# EasyEDA Pro project Project_file_OUR phone_2025-04-02.epro, schematic OURS PHONE_CONNECTORS_FLIP_1

## Sheets
1 CONNECTORS: Board Name: OURS PHONE_CONNECTORS_FLIP_1; Create Date: 2025-02-10; Page Name: CONNECTORS; Project Name: BackupProjects_abdulrehmanbinafsar_personal_0_20241230; Schematic Name: OURS PHONE_CONNECTORS_FLIP_1; Update Date: 2025-02-20; Add into BOM: yes; Company: Your Company; Convert to PCB: yes; Date: 2024-12-04; Draw By: Abdul Rehman; REV: 1.0; Sheet: 1/1
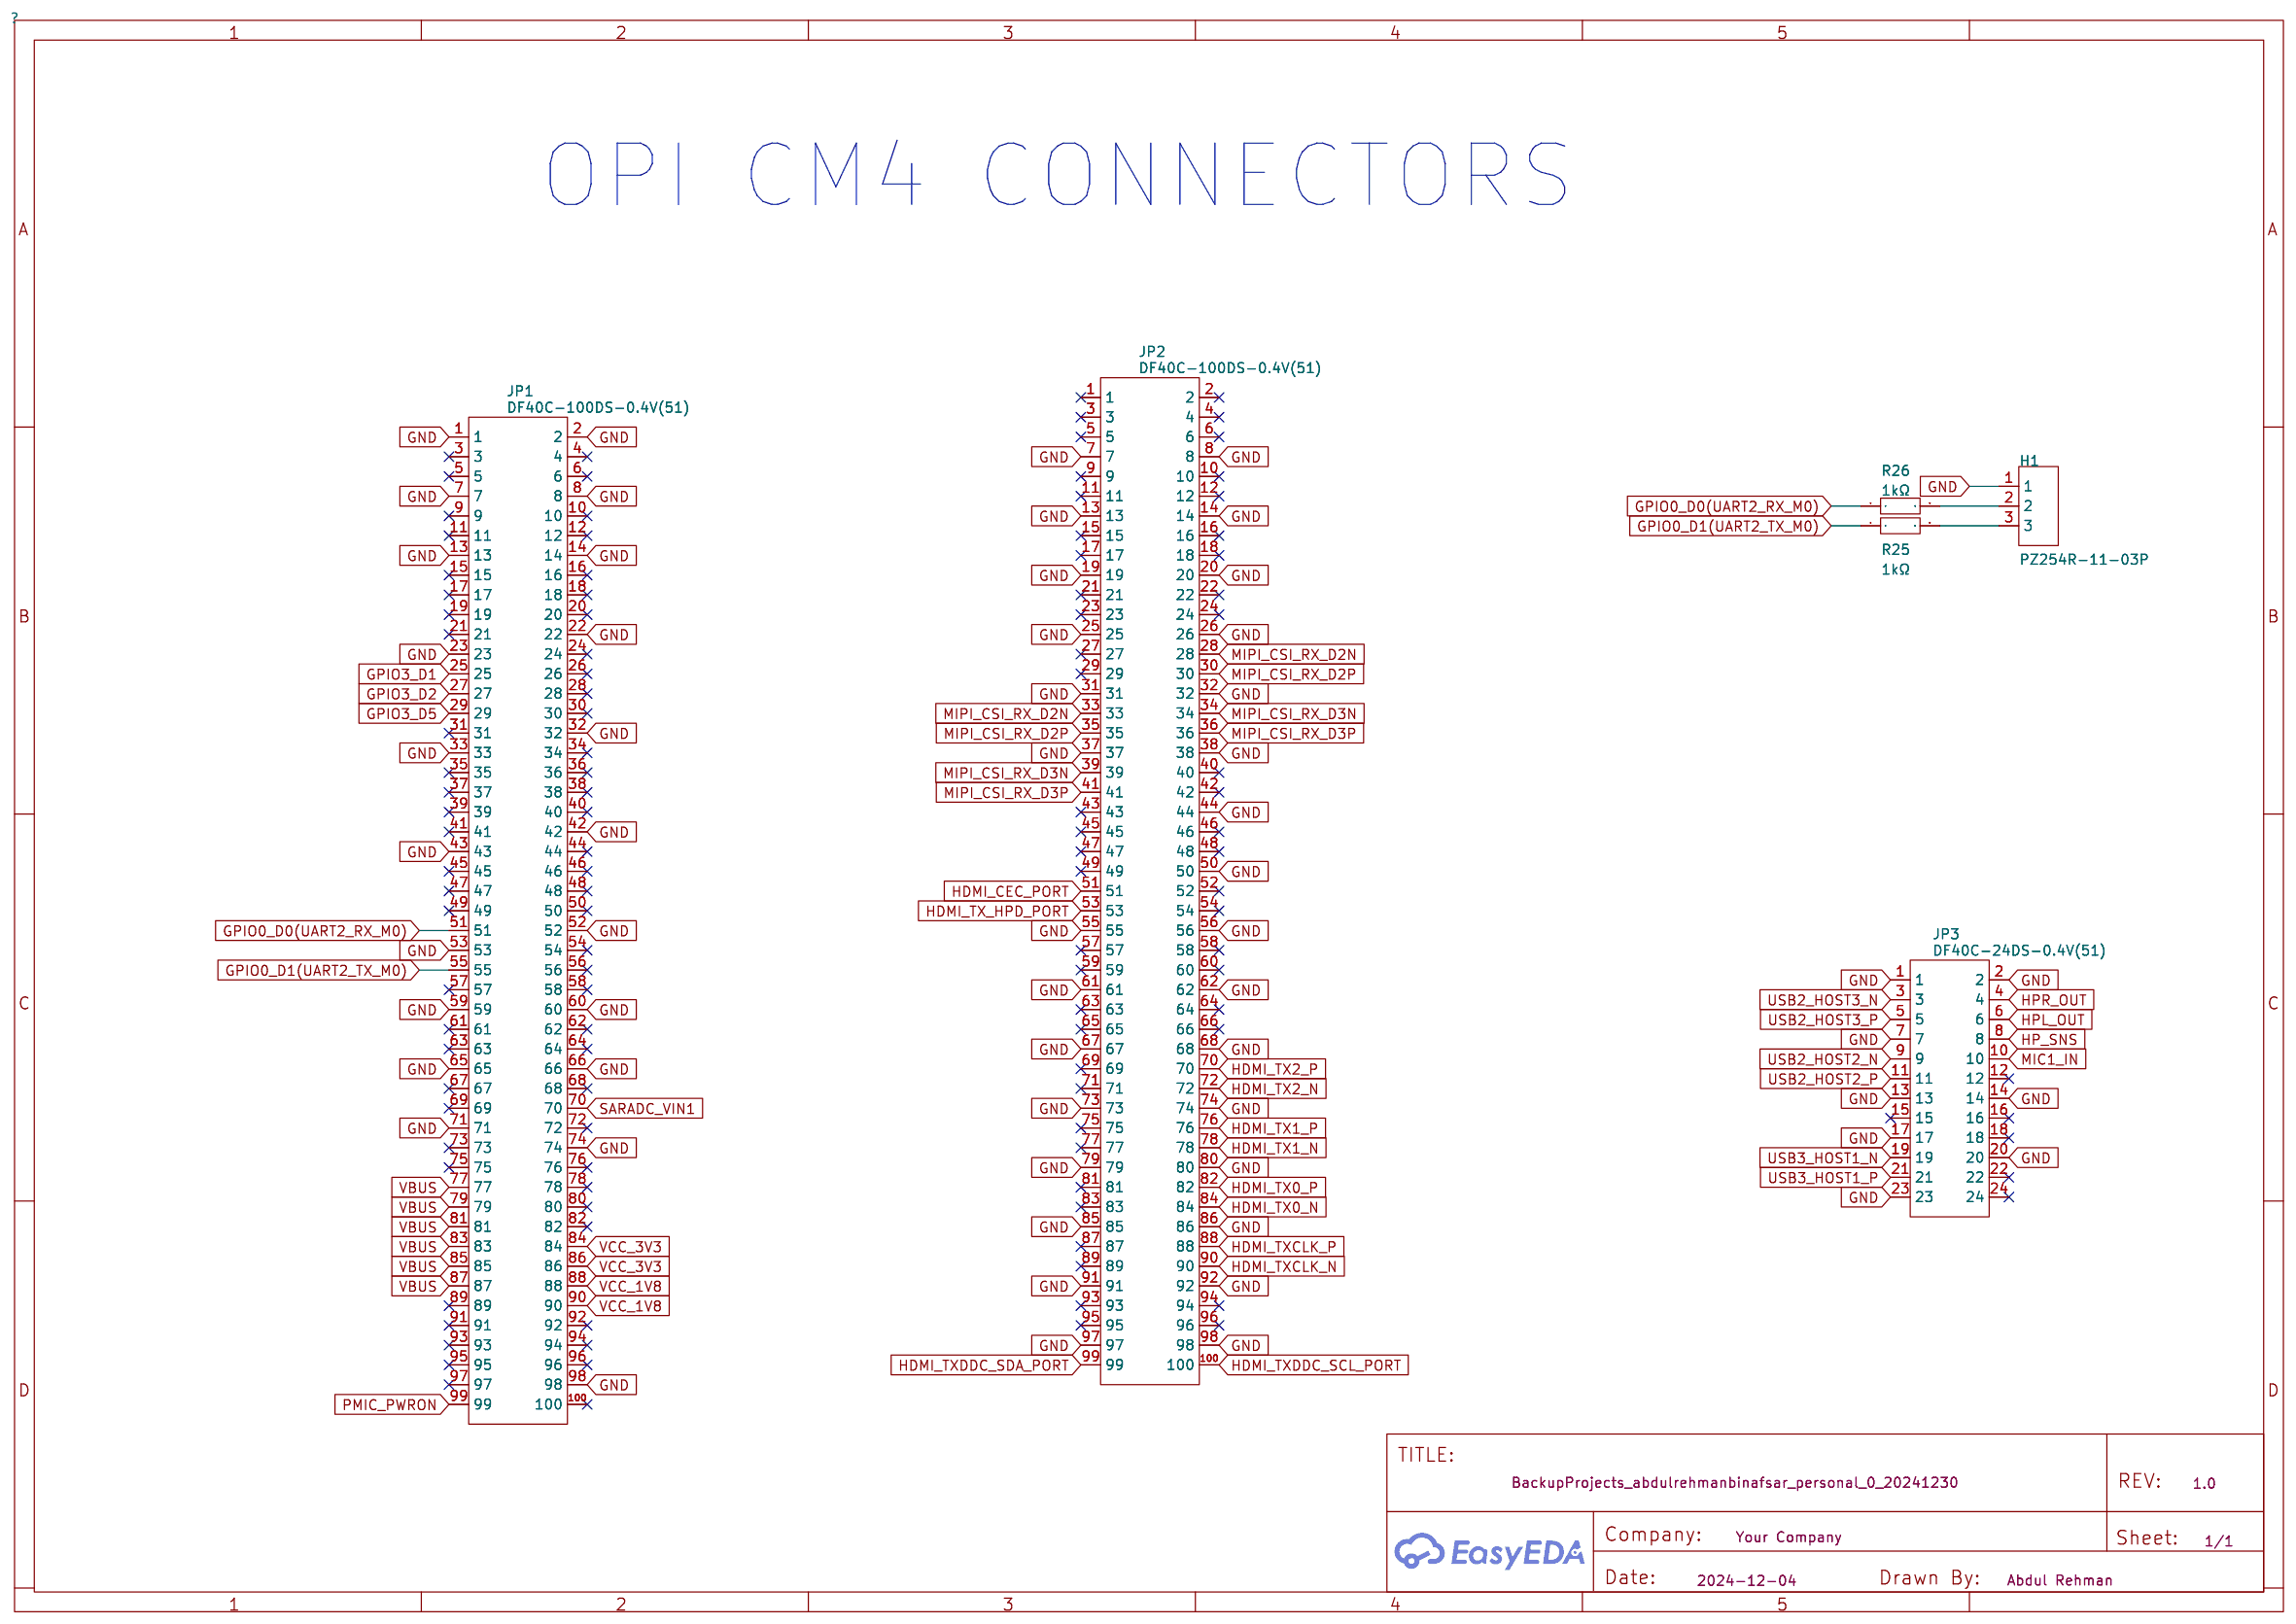
[diagram p5: CONNECTORS]
2 CIRCUITRY: Create Date: 2025-02-11; Page Name: CIRCUITRY; Update Date: 2025-04-01; Date: 2024-12-06
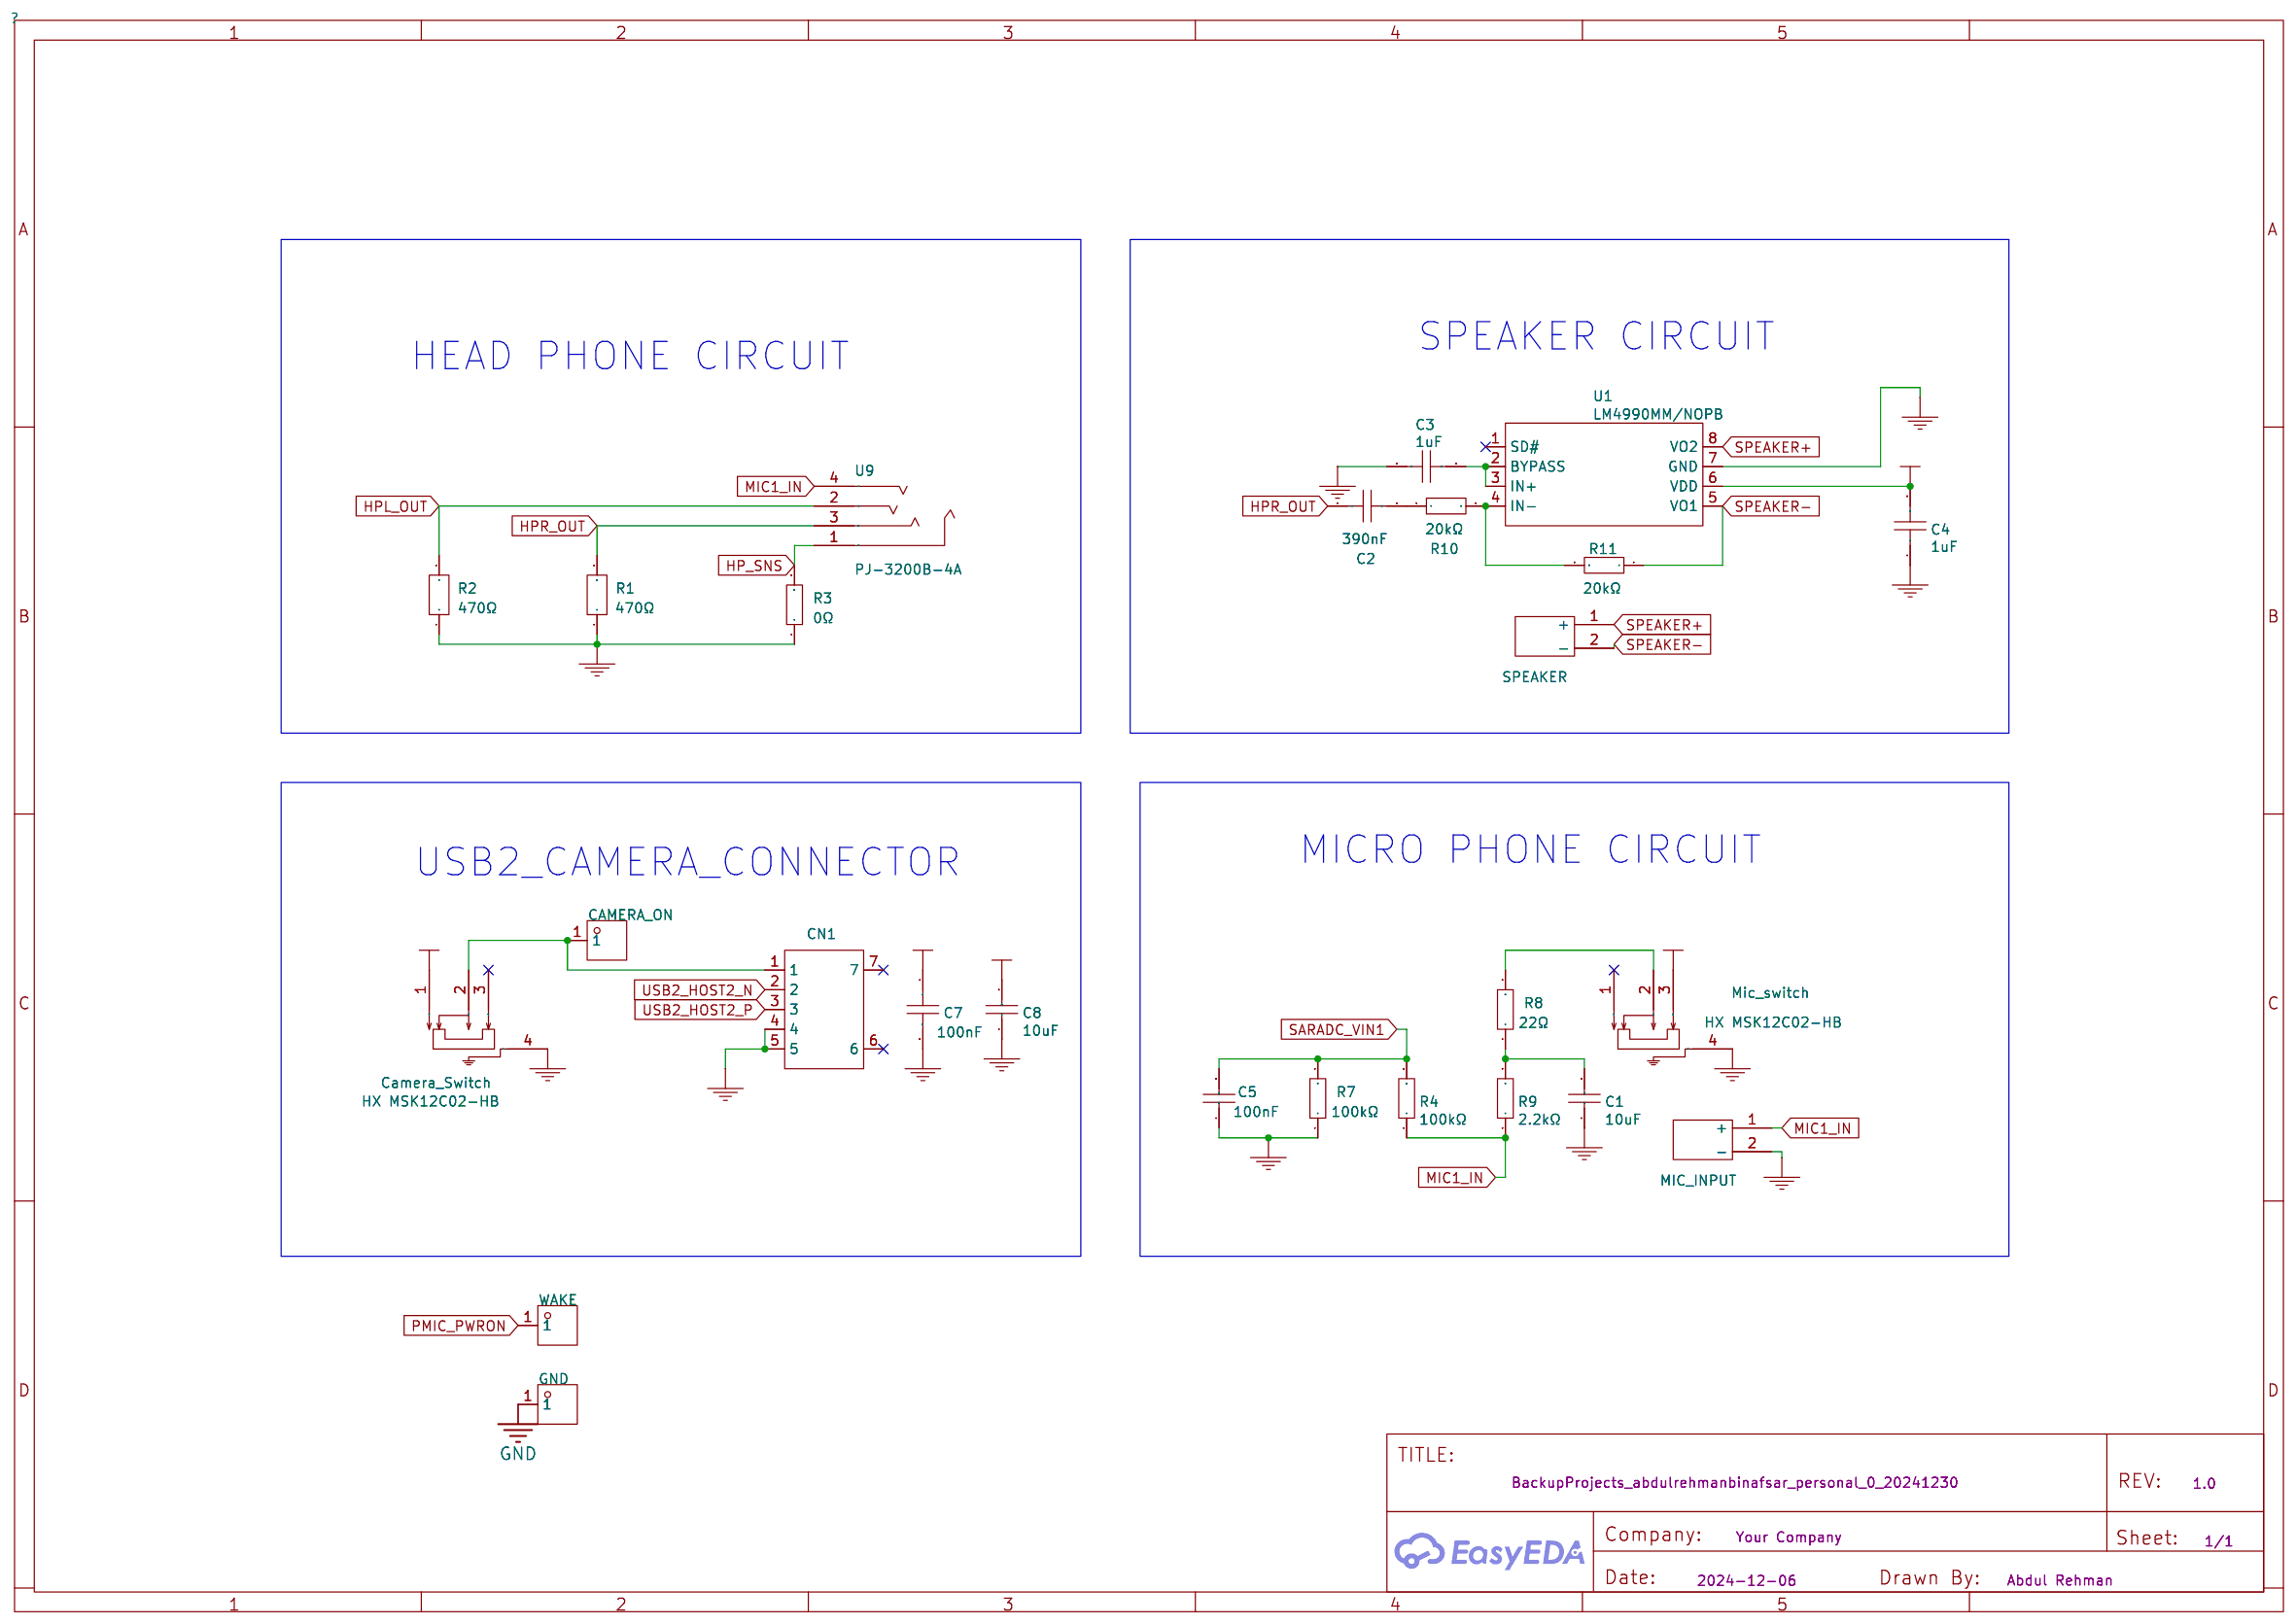
[diagram p6: CIRCUITRY]
3 SIM Module: Page Name: SIM Module; Update Date: 2025-02-26; Date: 2024-12-06
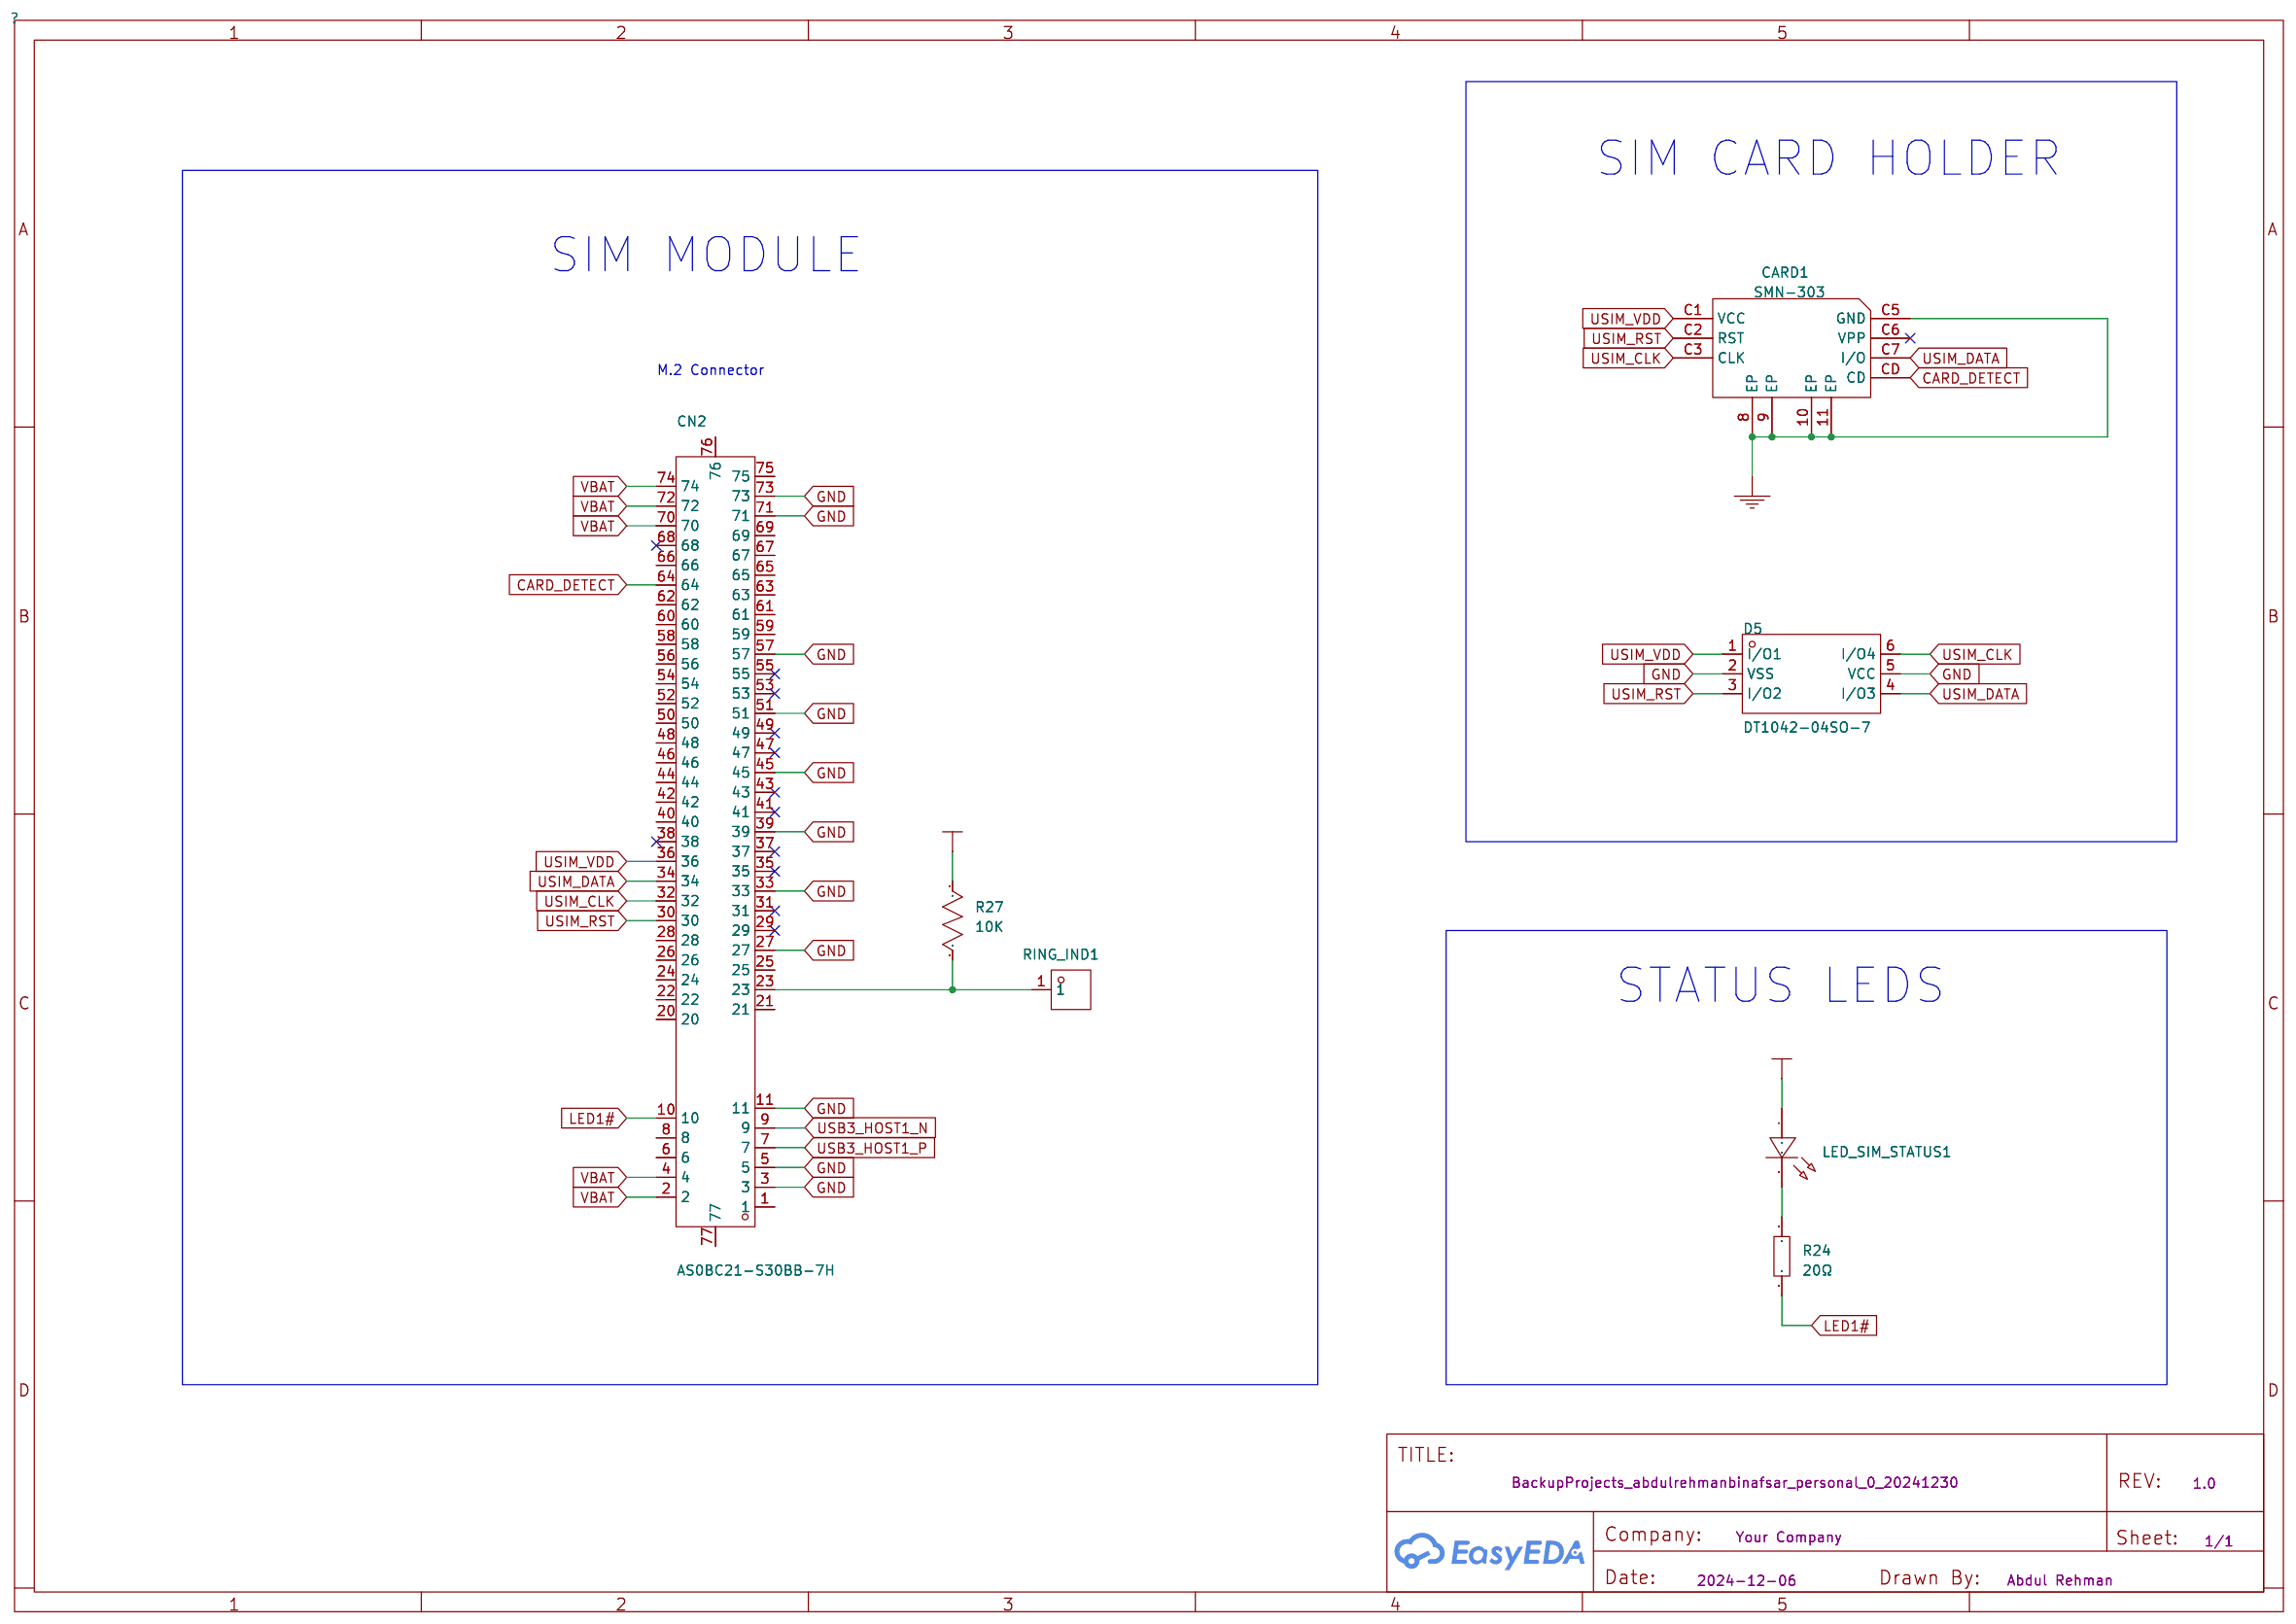
[diagram p7: SIM Module]
4 CPBR CIRCUIT: Create Date: 2025-02-11; Page Name: CPBR CIRCUIT; Update Date: 2025-04-01; Date: 2024-12-08
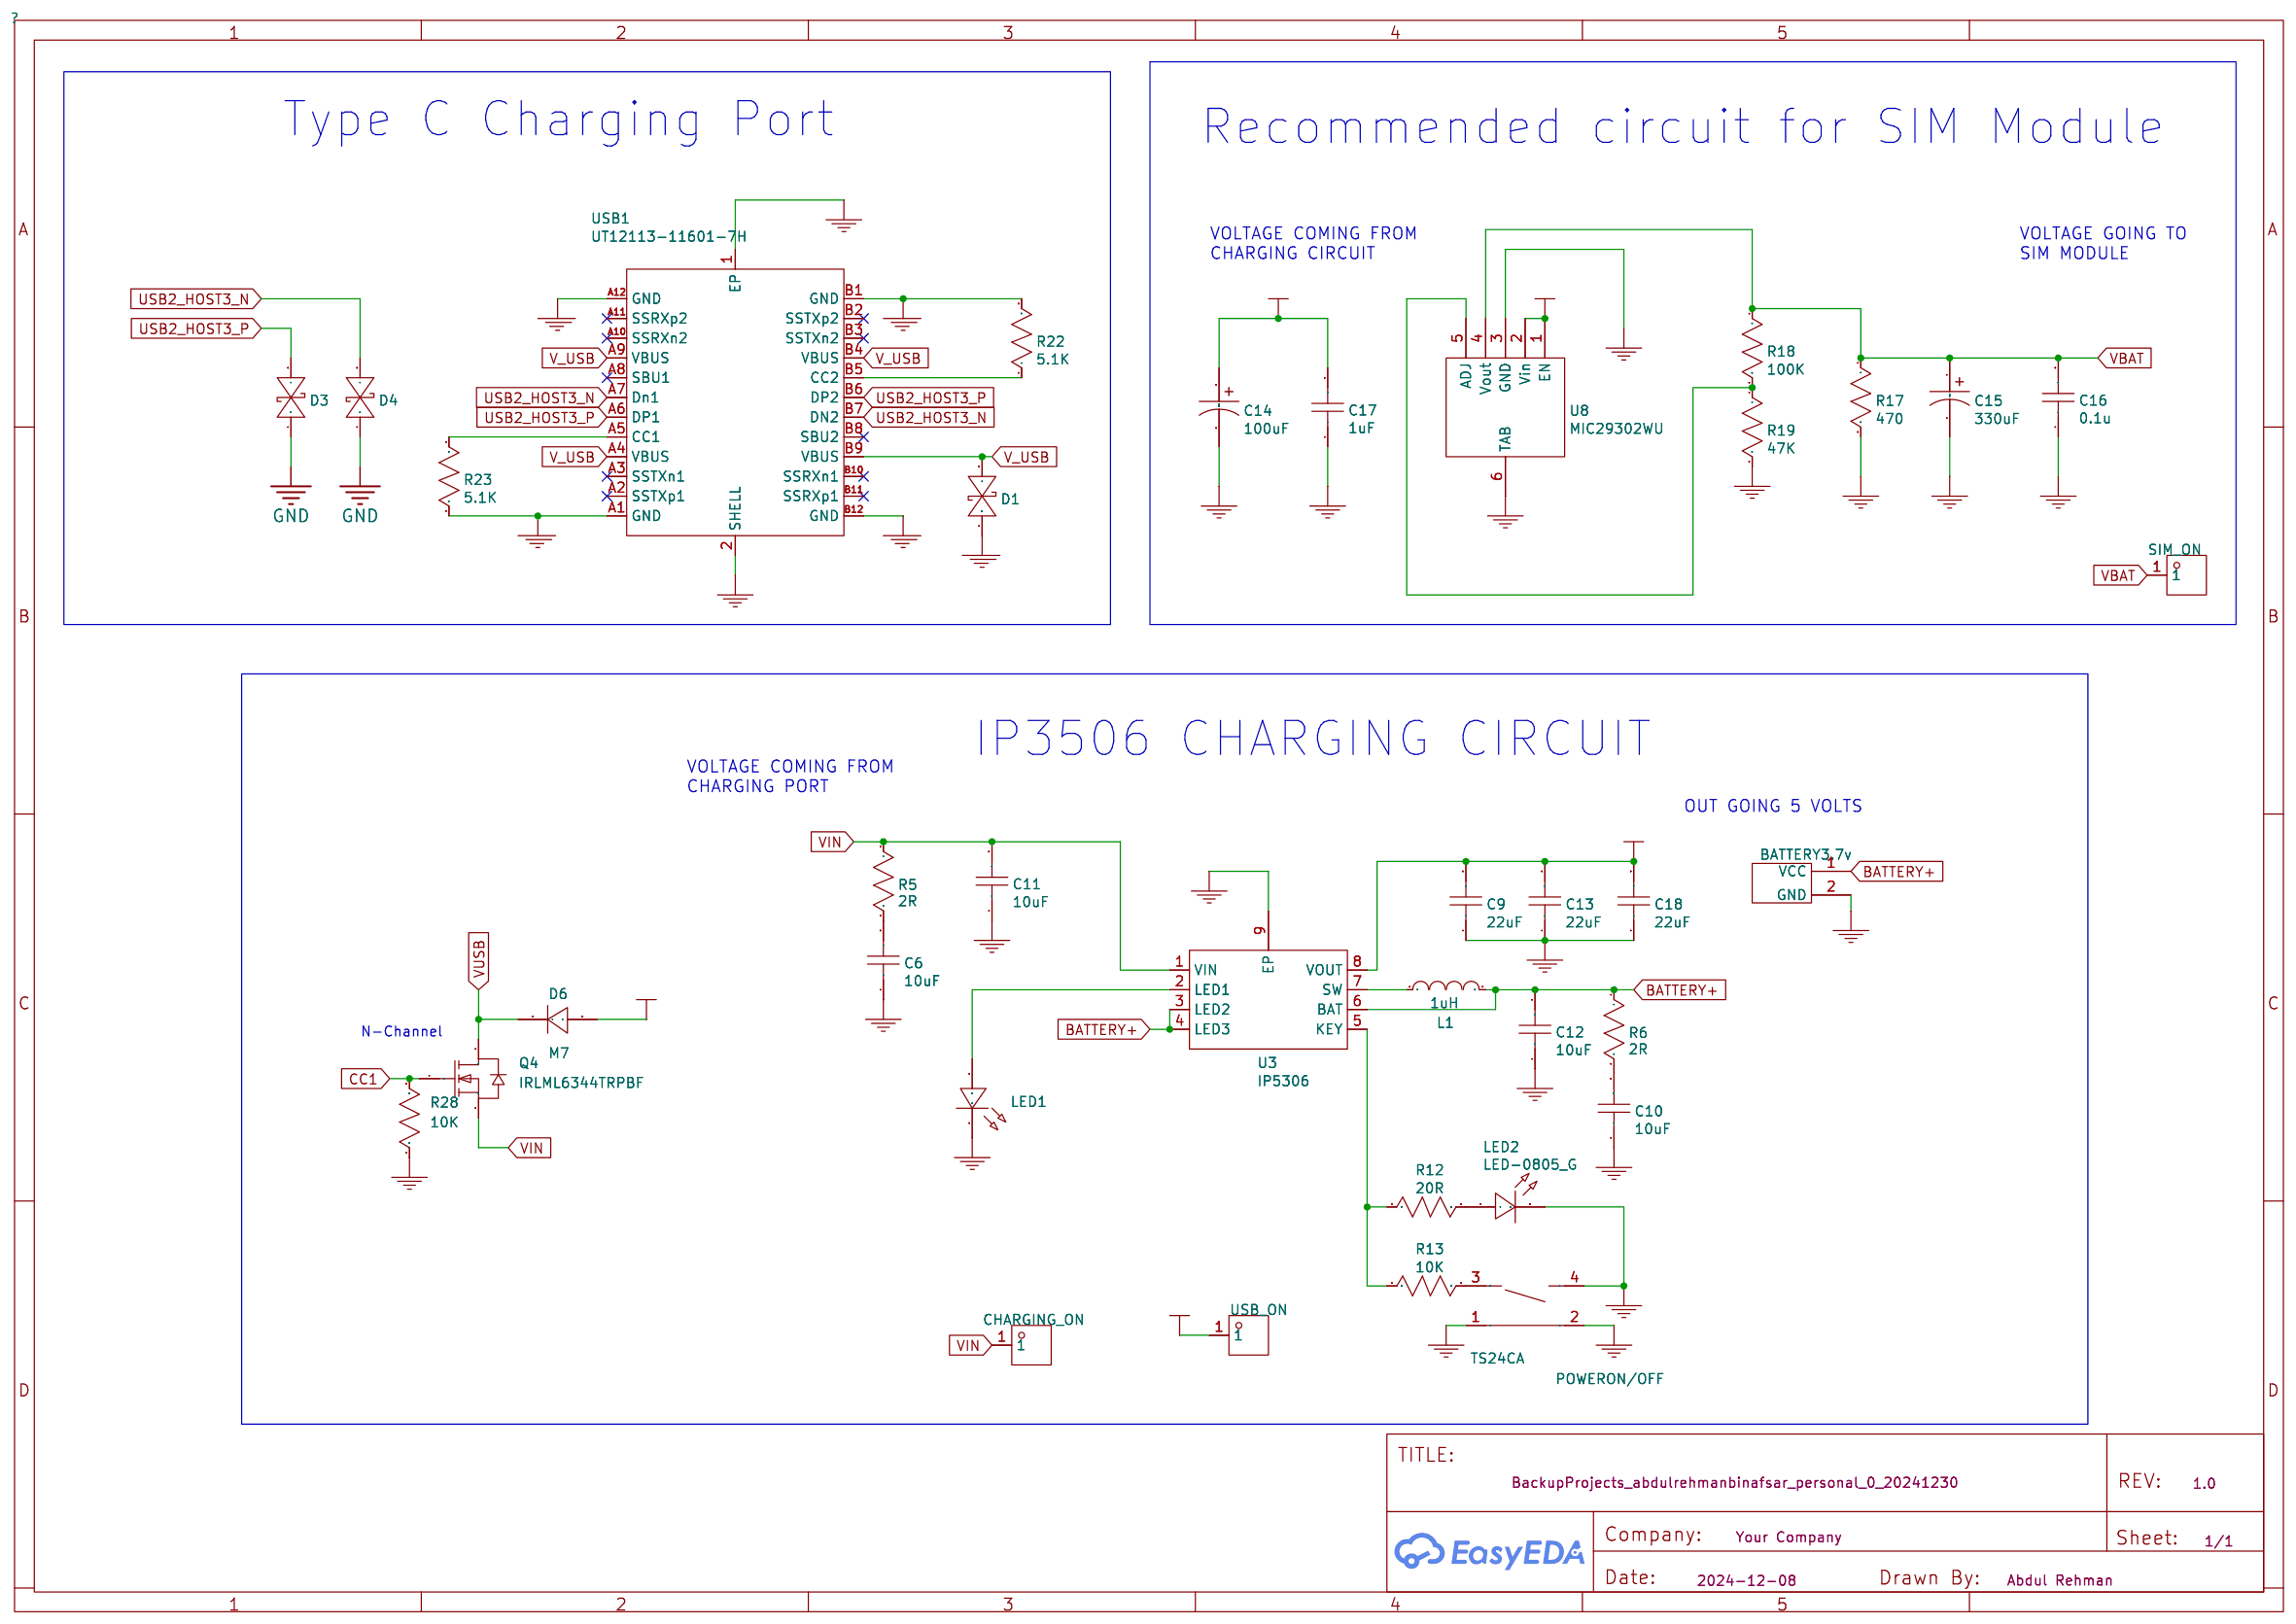
[diagram p8: CPBR CIRCUIT]
5 HDMI PORT: Create Date: 2025-02-11; Page Name: HDMI PORT; Update Date: 2025-04-01; Date: 2024-12-09
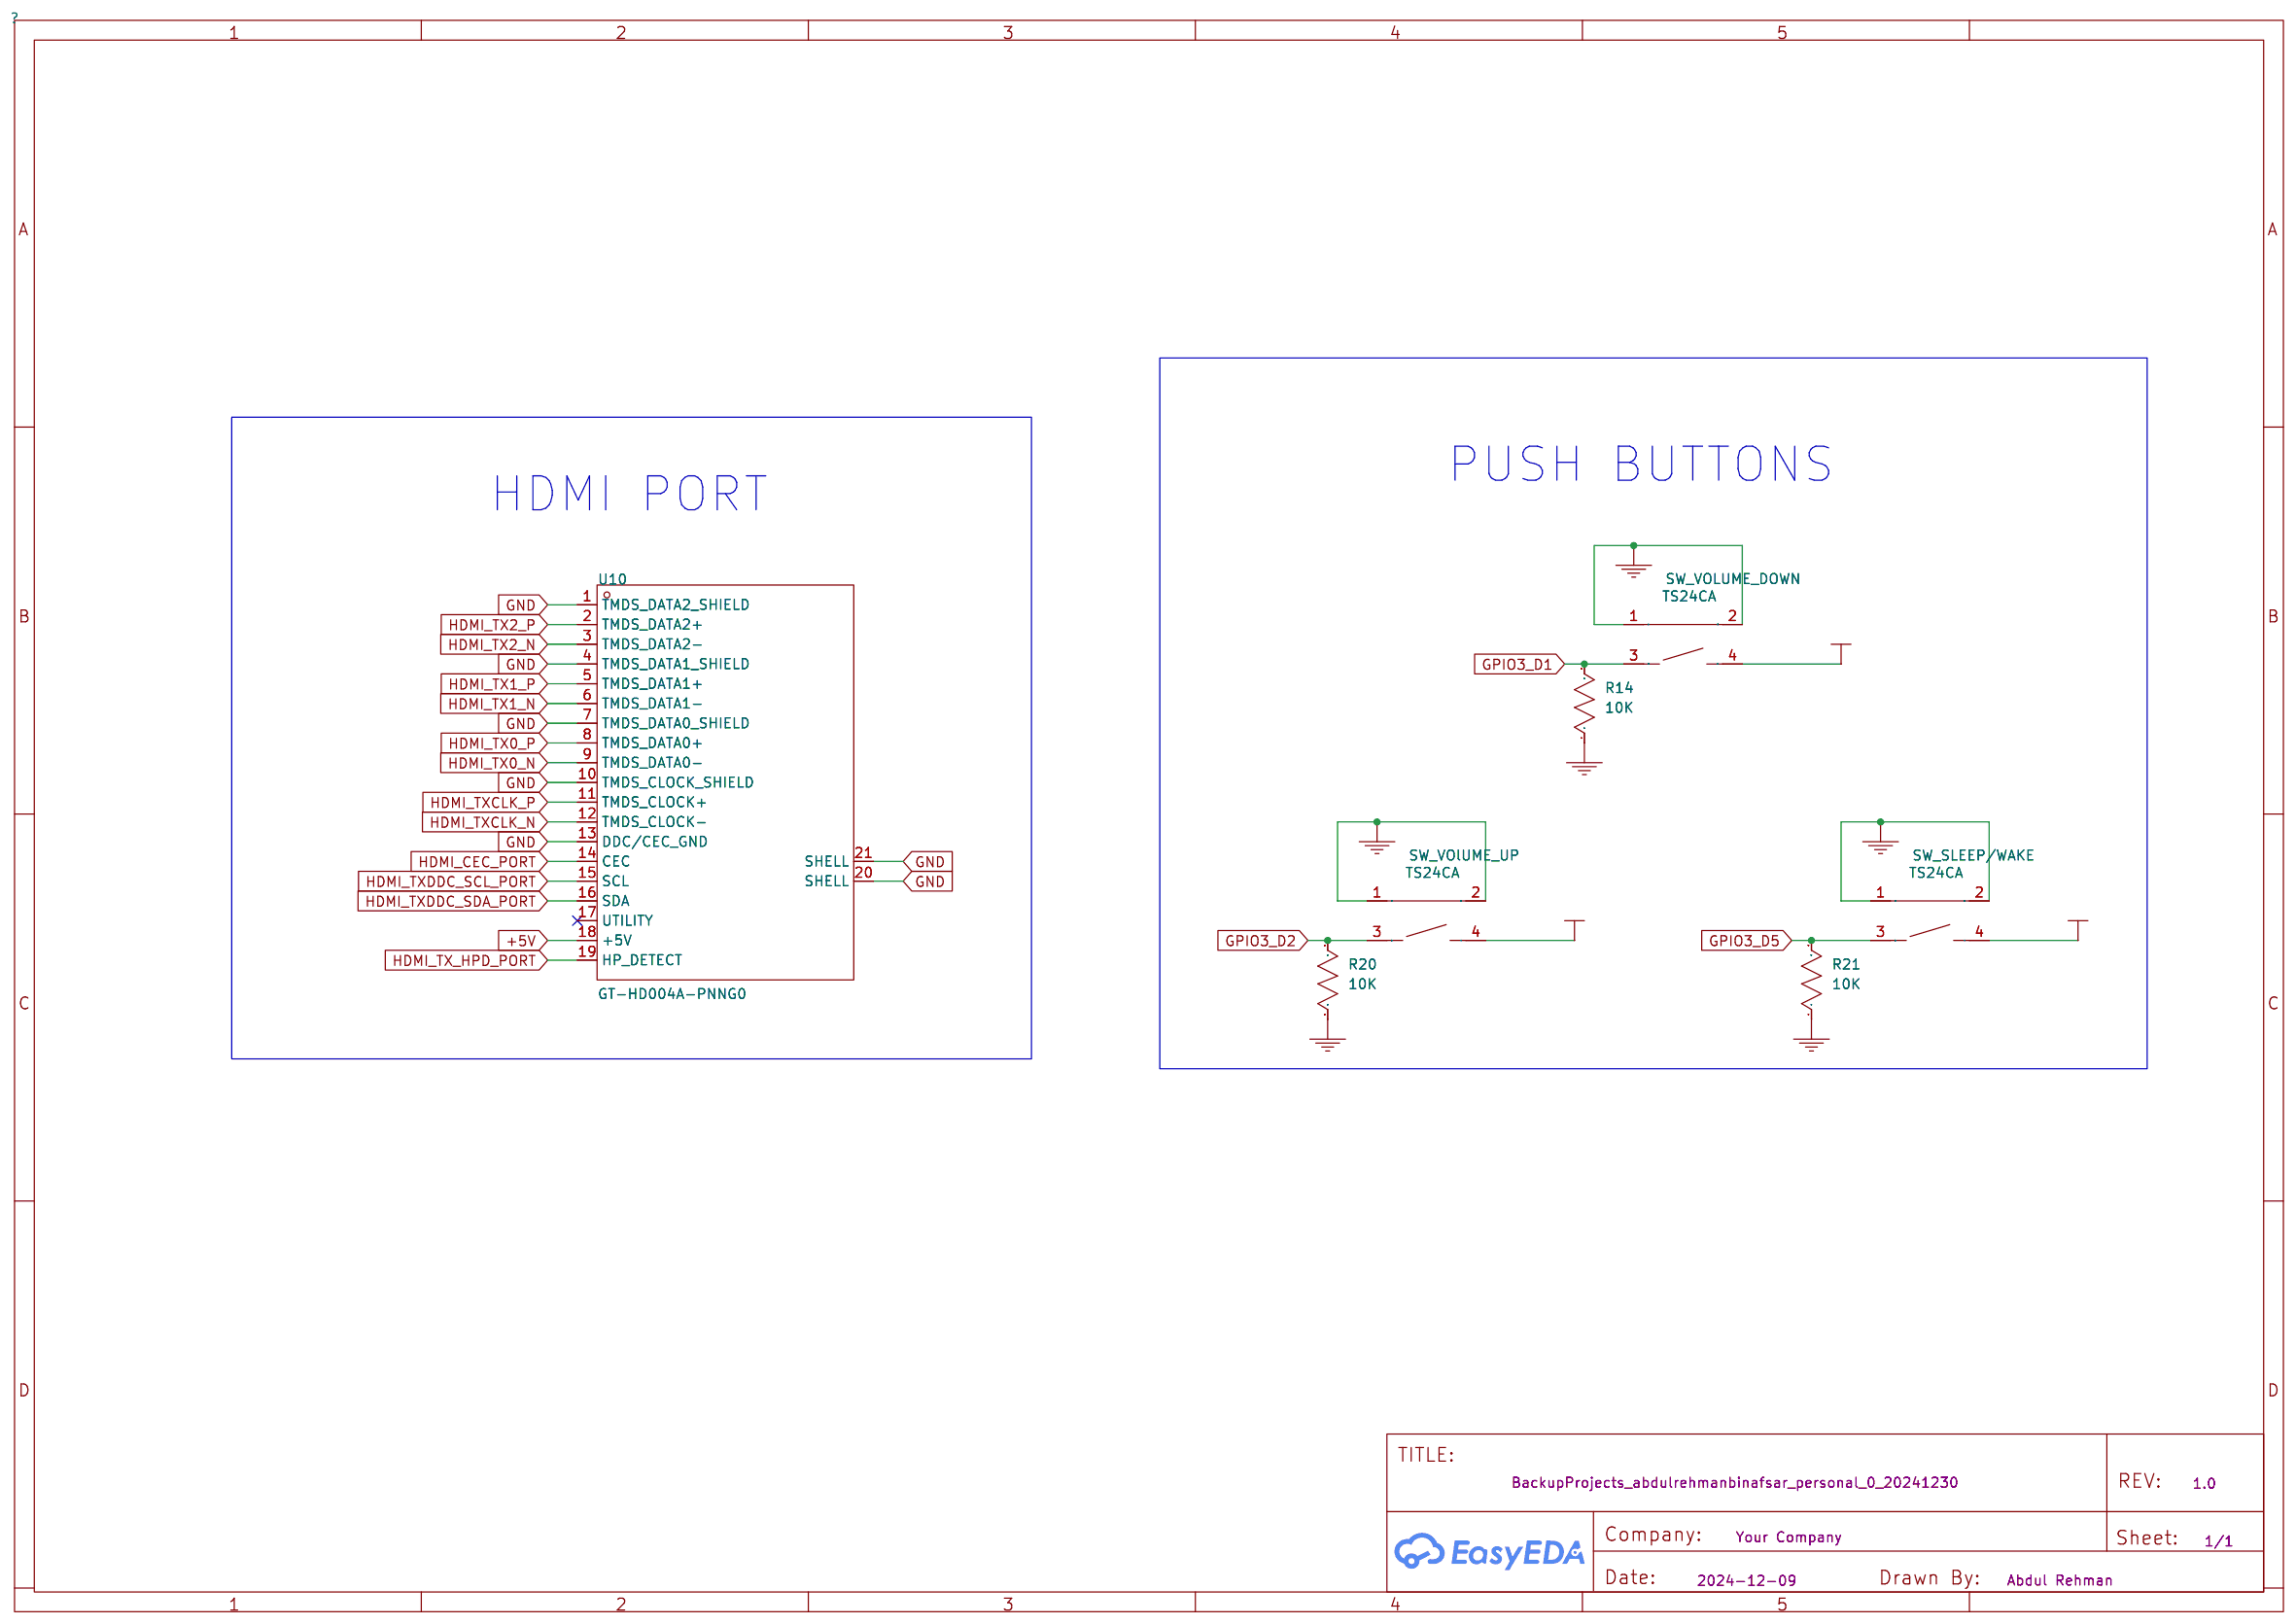
[diagram p9: HDMI PORT]

## Parts
sheet CIRCUITRY
C1  10uF  [C0402]
C2  390nF  [C0402]
C3  1uF  [C0402]
C4  1uF  [C0402]
C5  100nF  [C0402]
C7  100nF  [C0402]
C8  10uF  [C0402]
CAMERA_ON  TP-橘色测试点  [TESTPOINT-TH_BD3.2]  (no BOM)
Camera_Switch  HX MSK12C02-HB  [SW-SMD_MSK12C02-HB]
CN1  SM05B-SRSS-TB (LF)(SN)  [CONN-SMD_SM05B-SRSS-TB-LF-SN]
GND  TP-橘色测试点  [TESTPOINT-TH_BD3.2]  (no BOM)
MIC_INPUT  NOB  [BATTERY SYMBOL]  (no BOM)
Mic_switch  HX MSK12C02-HB  [SW-SMD_MSK12C02-HB]
R1  470Ω  [R0402]
R2  470Ω  [R0402]
R3  0Ω  [R0402]
R4  100kΩ  [R0402]
R7  100kΩ  [R0402]
R8  22Ω  [R0402]
R9  2.2kΩ  [R0402]
R10  20kΩ  [R0402]
R11  20kΩ  [R0402]
SPEAKER  NOB  [BATTERY SYMBOL]  (no BOM)
U1  LM4990MM/NOPB  [MSOP-8_L3.0-W3.0-P0.65-LS5.0-BL]
U9  PJ-3200B-4A  [AUDIO-TH_PJ-3200B-4A]
WAKE  TP-橘色测试点  [TESTPOINT-TH_BD3.2]  (no BOM)
sheet CONNECTORS
H1  PZ254R-11-03P  [HDR-TH_3P-P2.54-H-M-W10.4]
JP1  DF40C-100DS-0.4V(51)  [CONN-SMD_DF40C-100DS-0.4V-51]
JP2  DF40C-100DS-0.4V(51)  [CONN-SMD_DF40C-100DS-0.4V-51]
JP3  DF40C-24DS-0.4V(51)  [CONN-SMD_DF40C-24DS-0.4V51]
R25  1kΩ  [R0603]
R26  1kΩ  [R0603]
sheet CPBR CIRCUIT
BATTERY3.7v  NOB  [BATTERY SYMBOL]  (no BOM)
C6  10uF  [C0805]
C9  22uF  [C0805]
C10  10uF  [C0805]
C11  10uF  [C0805]
C12  10uF  [C0805]
C13  22uF  [C0805]
C14  100uF  [CASE-A_3216]
C15  330uF  [CASE-A_3216]
C16  0.1u  [C1206]
C17  1uF  [C1206]
C18  22uF  [C0805]
CHARGING_ON  TP-橘色测试点  [TESTPOINT-TH_BD3.2]  (no BOM)
D1  AZ5825-01F  [DFN-2L_L1.0-W0.6-P0.65-BI]
D3  AZ5825-01F  [DFN-2L_L1.0-W0.6-P0.65-BI]
D4  AZ5825-01F  [DFN-2L_L1.0-W0.6-P0.65-BI]
D6  M7  [SMA_L4.3-W2.6-LS5.2-RD]
L1  1uH  [IND-SMD_L2.5-W2.0]
LED1  LED-0603_G  [LED0603_GREEN]
LED2  LED-0805_G  [LED0805_GREEN]
POWERON/OFF  TS24CA  [SW-SMD_TS24CA]
Q4  IRLML6344TRPBF  [SOT-23-3_L2.9-W1.6-P1.90-LS2.8-BR]
R5  2R  [R0603]
R6  2R  [R0603]
R12  20R  [R0603]
R13  10K  [R0603]
R17  470  [R1206]
R18  100K  [R1206]
R19  47K  [R1206]
R22  5.1K  [R0805]
R23  5.1K  [R0805]
R28  10K  [R0603]
SIM_ON  TP-橘色测试点  [TESTPOINT-TH_BD3.2]  (no BOM)
U3  IP5306  [ESOP-8_L4.9-W3.9-P1.27-LS6.0-BL-EP]
U8  MIC29302WU  [TO-263-5_L10.2-W9.9-P1.70-LS14.4-TL]
USB1  UT12113-11601-7H  [USB-C-SMD_UT12113-11601-7H]
USB_ON  TP-橘色测试点  [TESTPOINT-TH_BD3.2]  (no BOM)
sheet HDMI PORT
R14  10K  [R0603]
R20  10K  [R0603]
R21  10K  [R0603]
SW_SLEEP/WAKE  TS24CA  [SW-SMD_TS24CA]
SW_VOLUME_DOWN  TS24CA  [SW-SMD_TS24CA]
SW_VOlUME_UP  TS24CA  [SW-SMD_TS24CA]
U10  GT-HD004A-PNNG0  [HDMI-SMD_GT-HD004A-FNNG0]
sheet SIM Module
CARD1  SMN-303  [SIM-SMD_SMN-303]
CN2  AS0BC21-S30BB-7H  [CONN-SMD_AS0BC21-S30BB-7H]
D5  DT1042-04SO-7  [SOT-26_L3.0-W1.6-P0.95-LS2.8-BL]
LED_SIM_STATUS1  LED-0805_B  [LED0805_BLUE]
R24  20Ω  [R0805]
R27  10K  [R0603]
RING_IND1  TP-橘色测试点  [TESTPOINT-TH_BD3.2]  (no BOM)

## Library data of the parts
C1 C8 = 10uF: Supplier: LCSC; Manufacturer: YAGEO(国巨); Manufacturer Part: CL05A106MQ5NUNC; Supplier Part: C15525; JLCPCB Part Class: Extended Part
C2 = 390nF: Supplier: LCSC; Supplier Part: C7393858; Manufacturer: CCTC(三环); Manufacturer Part: TCC0402X5R394K160AT; JLCPCB Part Class: Extended Part
C3 C4 = 1uF: Supplier: LCSC; Supplier Part: C318573; Manufacturer: SAMSUNG(三星); Manufacturer Part: CL05A105MQ5NNNC; JLCPCB Part Class: Extended Part
C5 = 100nF: Supplier: LCSC; Supplier Part: C106204; Manufacturer: YAGEO(国巨); Manufacturer Part: CC0402KRX5R7BB104; JLCPCB Part Class: Extended Part
C7 = 100nF: Supplier: LCSC; Supplier Part: C576741; Manufacturer: YAGEO(国巨); Manufacturer Part: CC0402MRX5R7BB104; JLCPCB Part Class: Extended Part
CAMERA_ON CHARGING_ON GND RING_IND1 SIM_ON USB_ON WAKE = TP-橘色测试点: Supplier Part: C9900007421; Supplier Footprint: TESTPOINT-TH_BD-2P-P2.00; JLCPCB Part Class: Extended Part; Supplier: LCSC
Camera_Switch Mic_switch = HX MSK12C02-HB: Supplier: LCSC; Supplier Part: C5149817; Manufacturer: hanxia(韩下); JLCPCB Part Class: Extended Part
CN1 = SM05B-SRSS-TB (LF)(SN): Supplier: LCSC; Supplier Part: C136657; Manufacturer: JST; Manufacturer Part: SM05B-SRSS-TB(LF)(SN); JLCPCB Part Class: Extended Part
BATTERY3.7v MIC_INPUT SPEAKER = NOB
R1 R2 = 470Ω: Supplier: LCSC; Supplier Part: C881295; Manufacturer: EVER OHMS(天二科技); Manufacturer Part: CR0402J470RQ10Z; JLCPCB Part Class: Extended Part
R3 = 0Ω: Supplier: LCSC; Supplier Part: C17168; Manufacturer: UNI-ROYAL(Uniroyal Elec); Manufacturer Part: 0402WGF0000TCE; JLCPCB Part Class: Extended Part
R4 R7 = 100kΩ: Supplier: LCSC; Manufacturer: YAGEO(国巨); Manufacturer Part: AC0402JR-07100KL; Supplier Part: C144732; JLCPCB Part Class: Extended Part
R8 = 22Ω: Supplier: LCSC; Supplier Part: C25092; Manufacturer: UNI-ROYAL(Uniroyal Elec); Manufacturer Part: 0402WGF220JTCE; JLCPCB Part Class: Extended Part
R9 = 2.2kΩ: Supplier: LCSC; Supplier Part: C269678; Manufacturer: Tyohm(幸亚电阻); Manufacturer Part: RMC04022.2K5%N; JLCPCB Part Class: Extended Part
R10 R11 = 20kΩ: Supplier: LCSC; Manufacturer: YAGEO(国巨); Manufacturer Part: RC0402FR-0720KL; Supplier Part: C93942; JLCPCB Part Class: Extended Part
U1 = LM4990MM/NOPB: Supplier: LCSC; Manufacturer: TI(德州仪器); Supplier Part: C8958; JLCPCB Part Class: Extended Part
U9 = PJ-3200B-4A: Connector Type:3.5mm耳机座 Current Rating (Max):500mA Voltage Rating (Max):30V; LCSC Part Name: 3.5mm耳机座; Supplier Part: C136687; Manufacturer: 韩国韩荣; Supplier Footprint: 插件; JLCPCB Part Class: Extended Part; Datasheet: https://atta.szlcsc.com/upload/public/pdf/source/20210429/C136687_4CC2DC59D4F83D423B9C10D95C628283.pdf; Supplier: LCSC; Connector Type: 3.5mm耳机座; Current Rating (Max): 500mA; Voltage Rating (Max): 30V
H1 = PZ254R-11-03P: Pin Structure:1x3P Pitch:2.54mm Row Spacing:- Circluar Pins/Square Pins:Policy Mounting Type:Right-Angle Number of Rows:Single Row Number of Pins:3P Current Rating:- Voltage Rating (Max):- Length of Mating Pin:6mm Insulation Height:2.5mm Contact Material:; LCSC Part Name: 1x3P 间距:2.54mm 方针 弯插; Supplier Part: C492411; Manufacturer: XFCN(兴飞); Supplier Footprint: 弯插,P=2.54mm; JLCPCB Part Class: Extended Part; Datasheet: https://atta.szlcsc.com/upload/public/pdf/source/20200309/C492411_5256E8AAA7569F6D33B6ADBFAE4F2888.pdf; Supplier: LCSC; Pin Structure: 1x3P; Pitch: 2.54mm; Circluar Pins/Square Pins: Policy; Mounting Type: Right-Angle; Number of Rows: Single Row; Number of Pins: 3P; Length of Mating Pin: 6mm; Insulation Height: 2.5mm; Contact Material: Brass; Operating Temperature: -40℃~+105℃; Color: Black
JP1 JP2 = DF40C-100DS-0.4V(51): Supplier: LCSC; Supplier Part: C597931; Manufacturer: HRS(广濑); JLCPCB Part Class: Extended Part
JP3 = DF40C-24DS-0.4V(51): Supplier: LCSC; Supplier Part: C424640; Manufacturer: HRS(广濑); JLCPCB Part Class: Extended Part
R25 R26 = 0603WAF1001T5E: Type:Thick Film Resistors Resistance:1kΩ Tolerance:±1% Tolerance:±1% Power(Watts): Overload Voltage (Max): Temperature Coefficient:±100ppm/℃ Temperature Coefficient:±100ppm/℃ Operating Temperature Range:-55℃~+155℃ Operating Temperature Range:-55℃~+155℃; LCSC Part Name: 1kΩ ±1% 100mW 厚膜电阻; Supplier Part: C21190; Manufacturer: UNI-ROYAL(厚声); Supplier Footprint: 0603; JLCPCB Part Class: Basic Part; Datasheet: https://atta.szlcsc.com/upload/public/pdf/source/20200306/C422600_1E6D84923E4A46A82E41ADD87F860B5C.pdf; Supplier: LCSC; Type: Thick Film Resistors; Tolerance: ±1%; Temperature Coefficient: ±100ppm/℃; Operating Temperature Range: -55℃~+155℃
C6 C10-C12 = 10uF: Supplier Part: C15850; Supplier: LCSC; Manufacturer Part: CL21A106KAYNNNE; TOLERANCE: 10%; Manufacturer: Samsung Electro-Mechanics
C9 C13 C18 = 22uF: Supplier Part: C602037; Supplier: LCSC; Manufacturer Part: CL21A226MAYNNNE; TOLERANCE: 10%; Manufacturer: Samsung Electro-Mechanics
C14 = 100uF: Supplier Part: C27279; Supplier: LCSC; Manufacturer Part: TLJA107M006R0800
C15 = 330uF: Supplier Part: C5162354; Supplier: LCSC; Manufacturer Part: CS1H331M-CRG10
C16 = 0.1u: Supplier Part: C3842156; Supplier: LCSC; Manufacturer Part: 1206B104J101CT
C17 = 1uF: Supplier Part: C445688; Supplier: LCSC; Manufacturer Part: In Stock C3216X8R1H105KT000N
D1 D3 D4 = AZ5825-01F: Supplier: LCSC; Supplier Part: C2905641; Manufacturer: TECH PUBLIC(台舟); JLCPCB Part Class: Extended Part
D6 = M7_C95872: Diode Configuration: Forward Voltage (Vf@If):1.1V@1A Reverse Voltage (Vr): Rectified Current: Reverse Leakage Current:5uA@1kV; LCSC Part Name: 电压:1kV 电流:1A; Supplier Part: C95872; Manufacturer: MDD(辰达半导体); Supplier Footprint: SMA(DO-214AC); JLCPCB Part Class: Basic Part; Datasheet: https://atta.szlcsc.com/upload/public/pdf/source/20230314/2A19294A7E86AE073FE0E8B47BC771B8.pdf; Supplier: LCSC; Forward Voltage (Vf@If): 1.1V@1A; Reverse Leakage Current: 5uA@1kV
L1 = 1uH: Supplier: LCSC; Supplier Part: C315711; Manufacturer: INPAQ(佳邦); Manufacturer Part: WIP252012P-1R0ML; JLCPCB Part Class: Extended Part
LED1 = LED-0603_G: Manufacturer: EVERLIGHT(台湾亿光); Manufacturer Part: PSC-1608U50GC-G4; Supplier Part: C22371298; Supplier: LCSC
LED2 = LED-0805_G: Manufacturer: 国星光电; Manufacturer Part: NCD0805G1; Supplier Part: C84260
POWERON/OFF SW_SLEEP/WAKE SW_VOLUME_DOWN SW_VOlUME_UP = TS24CA: Supplier: LCSC; Supplier Part: C393942; Manufacturer: SHOU HAN(首韩); JLCPCB Part Class: Extended Part
Q4 = IRLML6344TRPBF: Type:1 N-Channel Drain Source Voltage (Vdss): Continuous Drain Current (Id): Drain Source On Resistance (RDS(on)@Vgs,Id):29mΩ@4.5V,5.0A Power Dissipation (Pd): Gate Threshold Voltage (Vgs(th)@Id):1.1V@10uA Total Gate Charge (Qg@Vgs):6.8nC Input Capacitanc; LCSC Part Name: 1个N沟道 耐压:30V 电流:5A; Supplier Part: C53550; Manufacturer: Infineon(英飞凌); Supplier Footprint: SOT-23; JLCPCB Part Class: Extended Part; Datasheet: https://atta.szlcsc.com/upload/public/pdf/source/20210610/C53550_65719F40D28C6A3D6212C145E14C98AC.pdf; Supplier: LCSC; Type: 1 N-Channel; Drain Source On Resistance (RDS(on)@Vgs,Id): 29mΩ@4.5V,5.0A; Gate Threshold Voltage (Vgs(th)@Id): 1.1V@10uA; Total Gate Charge (Qg@Vgs): 6.8nC; Input Capacitance (Ciss@Vds): 650pF; Reverse Transfer Capacitance (Crss@Vds): 46pF; Operating Temperature: -55℃~+150℃
R5 R6 = 2R: Supplier Part: C325677; Supplier: LCSC; Manufacturer Part: RMC060321%N; TOLERANCE: 5%; Manufacturer: TyoHM
R12 = 20R: Supplier Part: C313703; Supplier: LCSC; Manufacturer Part: CRCW060320R0FKEAHP; TOLERANCE: 5%; Manufacturer: Vishay Intertech
R13 R14 R20 R21 R27 R28 = 10K: Supplier Part: C98220; Supplier: LCSC; Manufacturer Part: RC0603FR-0710KL; TOLERANCE: 5%; Manufacturer: YAGEO
R17 = 470: Supplier Part: C2765673; Supplier: LCSC; Manufacturer Part: CQ06W4J0471T5E; Manufacturer: UNI-ROYAL(Uniroyal Elec)
R18 = 100K: Supplier Part: C962669; Supplier: LCSC; Manufacturer Part: KTR18EZPJ104
R19 = 47K: Supplier Part: C872786; Supplier: LCSC; Manufacturer Part: RT1206FRE0747KL
R22 R23 = 5.1K: Supplier Part: C2077233; Supplier: LCSC; Manufacturer Part: CRCW080515K4FKEA
U3 = IP5306: Supplier: LCSC; Supplier Part: C181692; Manufacturer: INJOINIC(英集芯); JLCPCB Part Class: Extended Part
U8 = MIC29302WU: Supplier: LCSC; Manufacturer: MICROCHIP(美国微芯); Manufacturer Part: MIC29302WU-TR; Supplier Part: C11149; JLCPCB Part Class: Extended Part
USB1 = UT12113-11601-7H: Supplier: LCSC; Supplier Part: C2761409; Manufacturer: FOXCONN(富士康); JLCPCB Part Class: Extended Part
U10 = GT-HD004A-PNNG0: Connector Type:HDMI-D Gender:Female Number of Pins:19P Mounting Style:Horizontal attachment Current Rating (Max):1A Rated Voltage (Max):24V Operating Temperature Range:-40℃~+85℃ Operating Temperature Range:-40℃~+85℃; LCSC Part Name: 板上19pin HDMI DF前插后贴母座; Supplier Part: C27636752; Manufacturer: G-Switch(品赞); Supplier Footprint: SMD; JLCPCB Part Class: Extended Part; Datasheet: https://atta.szlcsc.com/upload/public/pdf/source/20250108/179803C09D1B5CD23D8E188BBAB0C6C4.pdf; Supplier: LCSC; Connector Type: HDMI-D; Gender: Female; Number of Pins: 19P; Mounting Style: Horizontal attachment; Current Rating (Max): 1A; Rated Voltage (Max): 24V; Operating Temperature Range: -40℃~+85℃
CARD1 = SMN-303: Supplier: LCSC; Supplier Part: C266888; Manufacturer: XUNPU(讯普); JLCPCB Part Class: Extended Part
CN2 = AS0BC21-S30BB-7H: Supplier Part: C2761344; Manufacturer: FOXCONN(富士康); Supplier Footprint: SMD,P=0.5mm,卧贴; JLCPCB Part Class: Extended Part; Datasheet: https://atta.szlcsc.com/upload/public/pdf/source/20210319/C2761342_D2293F5FD33DE8C4EE27F5BB0655C6EA.pdf; Supplier: LCSC
D5 = DT1042-04SO-7: Reverse Stand-Off Voltage (Vrwm):5V Maximum Clamping Voltage:9V Peak Pulse Power Dissipation (Ppp):55W Breakdown Voltage:6.2V Number of Lines:Four channels Operating Temperature:-55℃~+85℃@(Ta) Operating Temperature:-55℃~+85℃@(Ta) Type:ESD; Supplier Part: C460064; Manufacturer: DIODES(美台); Supplier Footprint: SOT-26; JLCPCB Part Class: Extended Part; Datasheet: https://atta.szlcsc.com/upload/public/pdf/source/20191129/C460064_2805D67BFF10BA05F1ABB14B65351125.pdf; Supplier: LCSC; Reverse Stand-Off Voltage (Vrwm): 5V; Maximum Clamping Voltage: 9V; Peak Pulse Power Dissipation (Ppp): 55W; Breakdown Voltage: 6.2V; Number of Lines: Four channels; Operating Temperature: -55℃~+85℃@(Ta); Type: ESD
LED_SIM_STATUS1 = LED-0805_B: Manufacturer: 方舟 ARKLED; Manufacturer Part: D-B080508B1-KS2; Supplier Part: C108412
R24 = 0805W8F200JT5E: Type:Thick Film Resistors Resistance:20Ω Tolerance:±1% Tolerance:±1% Power(Watts): Overload Voltage (Max): Temperature Coefficient:±200ppm/℃ Temperature Coefficient:±200ppm/℃ Operating Temperature Range:-55℃~+155℃ Operating Temperature Range:-55℃~+155℃; LCSC Part Name: 20Ω ±1% 125mW 厚膜电阻; Supplier Part: C17544; Manufacturer: UNI-ROYAL(厚声); Supplier Footprint: 0805; JLCPCB Part Class: Basic Part; Datasheet: https://atta.szlcsc.com/upload/public/pdf/source/20200306/C422600_1E6D84923E4A46A82E41ADD87F860B5C.pdf; Supplier: LCSC; Type: Thick Film Resistors; Tolerance: ±1%; Temperature Coefficient: ±200ppm/℃; Operating Temperature Range: -55℃~+155℃

## Nets
+5V: C4.2 C7.1 C8.2 C9.2 C13.2 C14.1 C17.2 C18.2 Camera_Switch.1 D6.2(A) SW_SLEEP/WAKE.4 SW_VOLUME_DOWN.4 SW_VOlUME_UP.4 U1.6(VDD) U3.8(VOUT) U8.1(EN) U8.2(Vin) U10.18(+5V) USB_ON.1
GND: BATTERY3.7v.2(GND) C1.1 C3.1 C4.1 C5.1 C6.1 C7.2 C8.1 C9.1 C10.1 C11.1 C12.1 C13.1 C14.2 C15.2 C16.1 C17.1 C18.1 Camera_Switch.4 CARD1.8(EP) CARD1.9(EP) CARD1.10(EP) CARD1.11(EP) CARD1.C5(GND) CN1.4 CN1.5 CN2.3 CN2.5 CN2.11 CN2.27 CN2.33 CN2.39 CN2.45 CN2.51 CN2.57 CN2.71 CN2.73 D1.1(C) D3.1(C) D4.1(C) D5.2(VSS) D5.5(VCC) GND.1 H1.1 JP1.1 JP1.2 JP1.7 JP1.8 JP1.13 JP1.14 JP1.22 JP1.23 JP1.32 JP1.33 JP1.42 JP1.43 JP1.52 JP1.53 JP1.59 JP1.60 JP1.65 JP1.66 JP1.71 JP1.74 JP1.98 JP2.7 JP2.8 JP2.13 JP2.14 JP2.19 JP2.20 JP2.25 JP2.26 JP2.31 JP2.32 JP2.37 JP2.38 JP2.44 JP2.50 JP2.55 JP2.56 JP2.61 JP2.62 JP2.67 JP2.68 JP2.73 JP2.74 JP2.79 JP2.80 JP2.85 JP2.86 JP2.91 JP2.92 JP2.97 JP2.98 JP3.1 JP3.2 JP3.7 JP3.13 JP3.14 JP3.17 JP3.20 JP3.23 LED1.2 LED2.2 MIC_INPUT.2(-) Mic_switch.4 POWERON/OFF.1 POWERON/OFF.2 POWERON/OFF.4 R1.1 R2.1 R3.1 R7.1 R14.1 R17.2 R19.2 R20.1 R21.1 R22.2 R23.1 R28.1 SW_SLEEP/WAKE.1 SW_SLEEP/WAKE.2 SW_VOLUME_DOWN.1 SW_VOLUME_DOWN.2 SW_VOlUME_UP.1 SW_VOlUME_UP.2 U1.7(GND) U3.9(EP) U8.3(GND) U8.6(TAB) U10.1(TMDS_DATA2_SHIELD) U10.4(TMDS_DATA1_SHIELD) U10.7(TMDS_DATA0_SHIELD) U10.10(TMDS_CLOCK_SHIELD) U10.13(DDC/CEC_GND) U10.20(SHELL) U10.21(SHELL) USB1.1(EP) USB1.2(SHELL) USB1.A1(GND) USB1.A12(GND) USB1.B1(GND) USB1.B12(GND)
VBAT: C15.1 C16.2 CN2.2 CN2.4 CN2.70 CN2.72 CN2.74 R17.1 R18.1 SIM_ON.1 U8.4(Vout)
VBUS: JP1.77 JP1.79 JP1.81 JP1.83 JP1.85 JP1.87
VCC_1V8: JP1.88 JP1.90
VCC_3V3: JP1.84 JP1.86 LED_SIM_STATUS1.1 Mic_switch.3 R27.1
VIN: C11.2 CHARGING_ON.1 Q4.2(S) R5.1 U3.1(VIN)
BATTERY+: BATTERY3.7v.1(VCC) C12.2 L1.2 R6.1 U3.3(LED2) U3.4(LED3) U3.6(BAT)
CARD_DETECT: CARD1.CD CN2.64
CC1: Q4.1(G) R28.2
GPIO0_D0(UART2_RX_M0): JP1.51 R26.1
GPIO0_D1(UART2_TX_M0): JP1.55 R25.1
GPIO3_D1: JP1.25 R14.2 SW_VOLUME_DOWN.3
GPIO3_D2: JP1.27 R20.2 SW_VOlUME_UP.3
GPIO3_D5: JP1.29 R21.2 SW_SLEEP/WAKE.3
HDMI_CEC_PORT: JP2.51 U10.14(CEC)
HDMI_TX0_N: JP2.84 U10.9(TMDS_DATA0-)
HDMI_TX0_P: JP2.82 U10.8(TMDS_DATA0+)
HDMI_TX1_N: JP2.78 U10.6(TMDS_DATA1-)
HDMI_TX1_P: JP2.76 U10.5(TMDS_DATA1+)
HDMI_TX2_N: JP2.72 U10.3(TMDS_DATA2-)
HDMI_TX2_P: JP2.70 U10.2(TMDS_DATA2+)
HDMI_TX_HPD_PORT: JP2.53 U10.19(HP_DETECT)
HDMI_TXCLK_N: JP2.90 U10.12(TMDS_CLOCK-)
HDMI_TXCLK_P: JP2.88 U10.11(TMDS_CLOCK+)
HDMI_TXDDC_SCL_PORT: JP2.100 U10.15(SCL)
HDMI_TXDDC_SDA_PORT: JP2.99 U10.16(SDA)
HP_SNS: JP3.8 R3.2 U9.1
HPL_OUT: JP3.6 R2.2 U9.2
HPR_OUT: C2.1 JP3.4 R1.2 U9.3
LED1#: CN2.10 R24.1
MIC1_IN: JP3.10 MIC_INPUT.1(+) R4.1 R9.1 U9.4
MIPI_CSI_RX_D2N: JP2.28 JP2.33
MIPI_CSI_RX_D2P: JP2.30 JP2.35
MIPI_CSI_RX_D3N: JP2.34 JP2.39
MIPI_CSI_RX_D3P: JP2.36 JP2.41
PMIC_PWRON: JP1.99 WAKE.1
SARADC_VIN1: C5.2 JP1.70 R4.2 R7.2
SPEAKER+: SPEAKER.1(+) U1.8(VO2)
SPEAKER-: R11.1 SPEAKER.2(-) U1.5(VO1)
USB2_HOST2_N: CN1.2 JP3.9
USB2_HOST2_P: CN1.3 JP3.11
USB2_HOST3_N: D4.2(A) JP3.3 USB1.A7(Dn1) USB1.B7(DN2)
USB2_HOST3_P: D3.2(A) JP3.5 USB1.A6(DP1) USB1.B6(DP2)
USB3_HOST1_N: CN2.9 JP3.19
USB3_HOST1_P: CN2.7 JP3.21
USIM_CLK: CARD1.C3(CLK) CN2.32 D5.6(I/O4)
USIM_DATA: CARD1.C7(I/O) CN2.34 D5.4(I/O3)
USIM_RST: CARD1.C2(RST) CN2.30 D5.3(I/O2)
USIM_VDD: CARD1.C1(VCC) CN2.36 D5.1(I/O1)
V_USB: D1.2(A) USB1.A4(VBUS) USB1.A9(VBUS) USB1.B4(VBUS) USB1.B9(VBUS)
VUSB: D6.1(K) Q4.3(D)
$1N4419: H1.3 R25.2
$1N4460: H1.2 R26.2
$2N2: CAMERA_ON.1 Camera_Switch.2 CN1.1
$2N7: C3.2 U1.2(BYPASS) U1.3(IN+)
$2N10: R10.2 R11.2 U1.4(IN-)
$2N12: C1.2 R8.1 R9.2
$2N528: C2.2 R10.1
$2N1557: Mic_switch.2 R8.2
$3N5360: LED_SIM_STATUS1.2 R24.2
$3N6118: CN2.23 R27.2 RING_IND1.1
$4N10: R18.2 R19.1 U8.5(ADJ)
$4N12: LED1.1 U3.2(LED1)
$4N15: L1.1 U3.7(SW)
$4N20: R12.1 R13.1 U3.5(KEY)
$4N24: R22.1 USB1.B5(CC2)
$4N26: R23.2 USB1.A5(CC1)
$4N691: C6.2 R5.2
$4N693: LED2.1 R12.2
$4N694: POWERON/OFF.3 R13.2
$4N11643: C10.2 R6.2

Not connected (* = marked no-connect by the designer): Camera_Switch 3*; CARD1 C6(VPP)*; CN1 6* 7*; CN2 1 6 8 20 21 22 24 25 26 28 29* 31* 35* 37* 38* 40 41* 42 43* 44 46 47* 48 49* 50 52 53* 54 55* 56 58 59 60 61 62 63 65 66 67 68* 69 75 76 77; JP1 3* 4* 5* 6* 9* 10* 11* 12* 15* 16* 17* 18* 19* 20* 21* 24* 26* 28* 30* 31* 34* 35* 36* 37* 38* 39* 40* 41* 44* 45* 46* 47* 48* 49* 50* 54* 56* 57* 58* 61* 62* 63* 64* 67* 68* 69* 72* 73* 75* 76* 78* 80* 82* 89* 91* 92* 93* 94* 95* 96* 97* 100*; JP2 1* 2* 3* 4* 5* 6* 9* 10* 11* 12* 15* 16* 17* 18* 21* 22* 23* 24* 27* 29* 40* 42* 43* 45* 46* 47* 48* 49* 52* 54* 57* 58* 59* 60* 63* 64* 65* 66* 69* 71* 75* 77* 81* 83* 87* 89* 93* 94* 95* 96*; JP3 12* 15* 16* 18* 22* 24*; Mic_switch 1*; U1 1(SD#)*; U10 17(UTILITY)*; USB1 A2(SSTXp1)* A3(SSTXn1)* A8(SBU1)* A10(SSRXn2)* A11(SSRXp2)* B2(SSTXp2)* B3(SSTXn2)* B8(SBU2)* B10(SSRXn1)* B11(SSRXp1)*

## Notes on the sheets
sheet 1
- OPI CM4 CONNECTORS
sheet 2
- SPEAKER CIRCUIT
- HEAD PHONE CIRCUIT
- MICRO PHONE CIRCUIT
- USB2_CAMERA_CONNECTOR
sheet 3
- SIM CARD HOLDER
- SIM MODULE
- M.2 Connector
- STATUS LEDS
sheet 4
- Type C Charging Port
- Recommended circuit for SIM Module
- VOLTAGE COMING FROM
- VOLTAGE GOING TO
- CHARGING CIRCUIT
- SIM MODULE
- VOLTAGE COMING FROM
- IP3506 CHARGING CIRCUIT
- CHARGING PORT
- OUT GOING 5 VOLTS
- N-Channel
sheet 5
- PUSH BUTTONS
- HDMI PORT
